# EAGLE design slave_node_v0.1 (EAGLE 9.6.2)

## Sheet 1 of 3
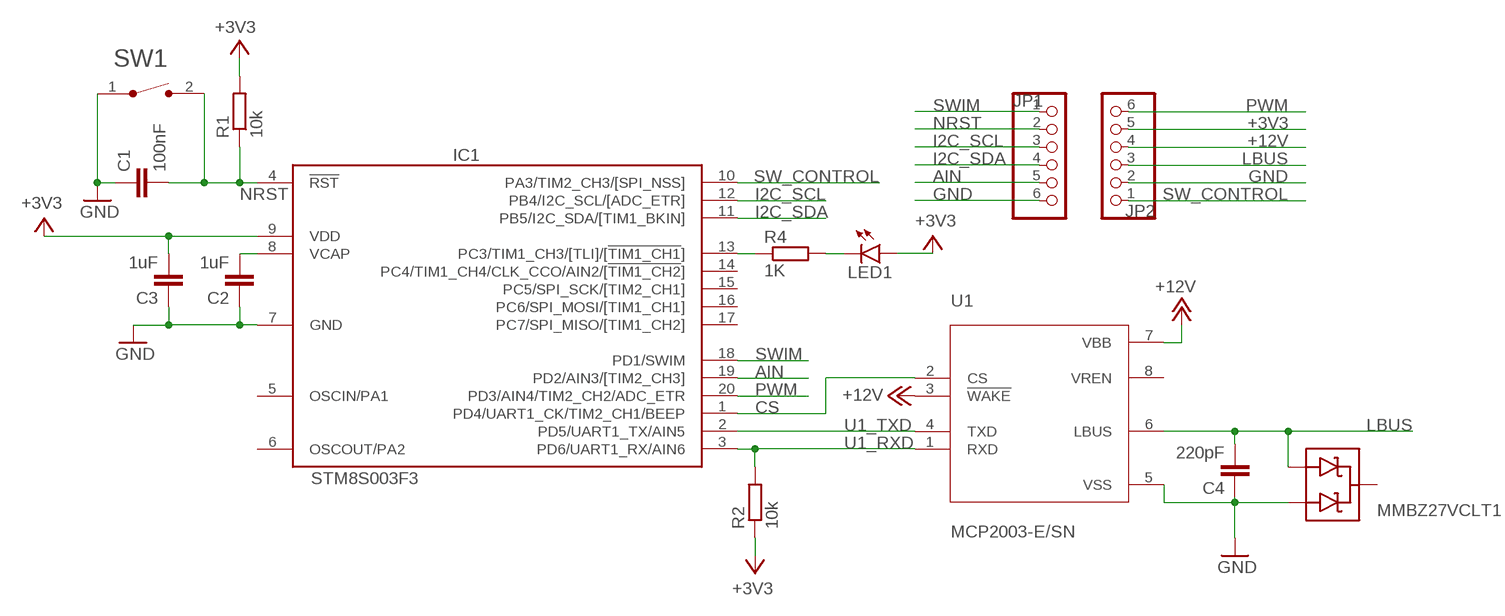
[diagram p0: schematic, sheet 1]

### Parts
C1  100nF  C-EUC0603  [C0603]
C2  1uF  C-EUC0603  [C0603]
C3  1uF  C-EUC0603  [C0603]
C4  220pF  C-EUC0603  [C0603]
D2  MMBZ27VCLT1  [SOT23-3]
IC1  STM8S003F3  [TSSOP20]
JP1  PINHD-1X6  [1X06]
JP2  PINHD-1X6  [1X06]
LED1  LEDCHIP-LED0603  [CHIP-LED0603]
R1  10k  R-EU_R0603  [R0603]
R2  10k  R-EU_R0603  [R0603]
R4  1K  R-EU_R0603  [R0603]
SW1  FSMSM  [TE_FSMSM]
U1  MCP2003-E/SN  [SOIC127P600X175-8N]

### Nets
+3V3: C3.2 IC1.9(VDD) JP2.5 LED1.A R1.2 R2.1 ; also sheet 3
+12V: JP2.4 U1.3(!WAKE) U1.7(VBB) ; also sheet 2,3
AIN: IC1.19(PD2/AIN3/[TIM2_CH3]) JP1.5
CS: IC1.1(PD4/UART1_CK/TIM2_CH1/BEEP) U1.2(CS)
GND: C1.1 C2.1 C3.1 C4.1 D2.1(A1) IC1.7(GND) JP1.6 JP2.2 SW1.1 U1.5(VSS) ; also sheet 2,3
I2C_SCL: IC1.12(PB4/I2C_SCL/[ADC_ETR]) JP1.3
I2C_SDA: IC1.11(PB5/I2C_SDA/[TIM1_BKIN]) JP1.4
LBUS: C4.2 D2.2(A2) JP2.3 U1.6(LBUS)
N$2: C2.2 IC1.8(VCAP)
N$3: LED1.C R4.2
N$4: IC1.13(PC3/TIM1_CH3/[TLI]/[!TIM1_CH1!]) R4.1
NRST: C1.2 IC1.4(!RST) JP1.2 R1.1 SW1.2
PWM: IC1.20(PD3/AIN4/TIM2_CH2/ADC_ETR) JP2.6
SW_CONTROL: IC1.10(PA3/TIM2_CH3/[SPI_NSS]) JP2.1 ; also sheet 2
SWIM: IC1.18(PD1/SWIM) JP1.1
U1_RXD: IC1.3(PD6/UART1_RX/AIN6) R2.2 U1.1(RXD)
U1_TXD: IC1.2(PD5/UART1_TX/AIN5) U1.4(TXD)
Unconnected: D2.3(C) IC1.5(OSCIN/PA1) IC1.6(OSCOUT/PA2) IC1.14(PC4/TIM1_CH4/CLK_CCO/AIN2/[!TIM1_CH2!]) IC1.15(PC5/SPI_SCK/[TIM2_CH1]) IC1.16(PC6/SPI_MOSI/[TIM1_CH1]) IC1.17(PC7/SPI_MISO/[TIM1_CH2]) U1.8(VREN)

## Sheet 2 of 3
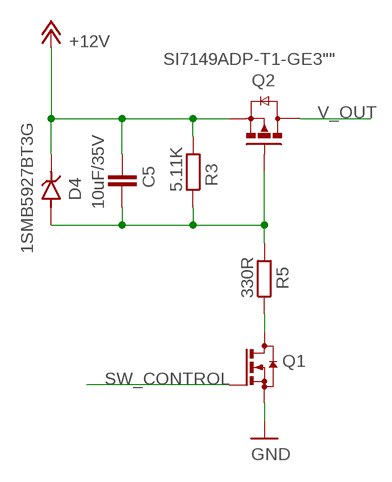
[diagram p1: schematic, sheet 2]

### Parts
C5  C-EUC0603  [C0603]
D4  1SMB5927BT3G  [DIOM5436X247N]
Q1  BSS123  [SOT23]
Q2  SI7149ADP-T1-GE3""  [POWERPAKSO-8]
R3  R-EU_R0603  [R0603]
R5  R-EU_R0603  [R0603]

### Nets
+12V: C5.1 D4.C(K) Q2.1(S) Q2.2(S) Q2.3(S) R3.2 ; also sheet 1,3
GND: Q1.2(S) ; also sheet 1,3
N$5: Q1.3(D) R5.1
N$6: C5.2 D4.A Q2.4(G) R3.1 R5.2
SW_CONTROL: Q1.1(G) ; also sheet 1
V_OUT: Q2.5(D) Q2.6(D) Q2.7(D) Q2.8(D) Q2.9(D)

## Sheet 3 of 3
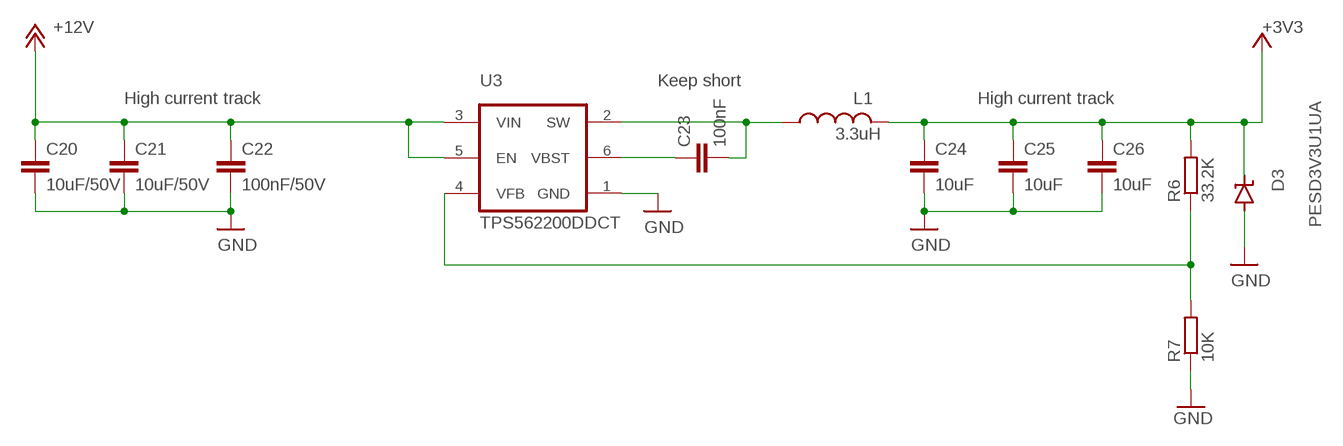
[diagram p2: schematic, sheet 3]

### Parts
C20  10uF/50V  C-EUC0603  [C0603]
C21  10uF/50V  C-EUC0603  [C0603]
C22  100nF/50V  C-EUC0603  [C0603]
C23  100nF  C-EUC0603  [C0603]
C24  10uF  C-EUC0603  [C0603]
C25  10uF  C-EUC0603  [C0603]
C26  10uF  C-EUC0603  [C0603]
D3  PESD3V3U1UA  [SOD323]
L1  3.3uH  MBMK2520H3R3M  [INDC2520X120N]
R6  33.2K  R-EU_R0603  [R0603]
R7  10K  R-EU_R0603  [R0603]
U3  TPS562200DDCT  [SOT95P280X110-6N]

### Nets
+3V3: C24.1 C25.1 C26.1 D3.C L1.2 R6.2 ; also sheet 1
+12V: C20.1 C21.1 C22.1 U3.3(VIN) U3.5(EN) ; also sheet 1,2
GND: C20.2 C21.2 C22.2 C24.2 C25.2 C26.2 D3.A R7.1 U3.1(GND) ; also sheet 1,2
N$21: R6.1 R7.2 U3.4(VFB)
N$29: C23.2 L1.1 U3.2(SW)
N$68: C23.1 U3.6(VBST)

### Notes on the sheet
- Keep short
- High current track | High current track

## Library data of the parts
C1-C4 C20-C26 = rcl:C-EU: CAPACITOR, European symbol; SPICEPREFIX: C
C5 = rcl:C-EU: CAPACITOR, European symbol; C1: 10uF/35V; SPICEPREFIX: C
D2 = opaygolink:MMBZ27VCLT1: 40W Zener-diode transient voltage suppressor (ESD protection); AVAILABILITY: Unavailable; DESCRIPTION: 38V Clamp 1A Ipp Tvs Diode Surface Mount SOT-23-3 _TO-236_; MF: ON Semiconductor; MP: MMBZ27VCLT1; PACKAGE: SOT-23-3 ON Semiconductor; PRICE: None; SPICEPREFIX: U
D3 = opaygolink:PESD3V3U1UA: PESD3V3U1UA
D4 = opaygolink:1SMB5927BT3G: Zener Diode 5.6V 3W ±5% Surface Mount SMB Check prices <https://pricing.snapeda.com/parts/1SMB5927BT3G/ON%20Semiconductor/view-part?ref=eda>; AVAILABILITY: Good; DESCRIPTION: Zener Diode 12V 3W ±5% Surface Mount SMB; MF: ON Semiconductor; MP: 1SMB5927BT3G; PACKAGE: SMB-2 ON Semiconductor; PRICE: None; PURCHASE-URL: https://pricing.snapeda.com/search/part/1SMB5927BT3G/?ref=eda
IC1 = opaygolink:STM8S003: Value line, 16 MHz STM8S 8-bit MCU, 8 Kbytes Flash, 128 bytes data EEPROM, 10-bit ADC, 3 timers, UART, SPI, I2C
JP1 JP2 = opaygolink:PINHD-1X6: PIN HEADER
L1 = opaygolink:MBMK2520H3R3M: INDUCTOR,MCOIL HIGH CURRENT,3.3UH30% ,T&R; DESCRIPTION: 3.3µH Shielded Wirewound Inductor 970mA 260mOhm Max 1008 _2520 Metric_; DIGI-KEY_PART_NUMBER: 587-4723-1-ND; DIGI-KEY_PURCHASE_URL: https://www.digikey.es/product-detail/en/taiyo-yuden/MBMK2520H3R3M/587-4723-1-ND/6181929?utm_source=snapeda&utm_medium=aggregator&utm_campaign=symbol; MF: Taiyo Yuden; MP: MBMK2520H3R3M; PACKAGE: 2520 Taiyo Yuden
LED1 = led:LED: LED OSRAM: - CHIPLED LG R971, LG N971, LY N971, LG Q971, LY Q971, LO R971, LY R971 LH N974, LH R974 LS Q976, LO Q976, LY Q976 LO Q996 - Hyper CHIPLED LW Q18S LB Q993, LB Q99A, LB R99A - SideLED LS A670, LO A670, LY A670, LG A670, LP A670 LB A673, LV A673, LT A673, LW A673 LH A674 LY A675 LS A676, LA A676, LO A676, LY A676, LW A676 LS A679, LY A679, LG A679 - Hyper Micro SIDELED® LS Y876, LA Y876, LO Y876, LY Y876 LT Y87S - SmartLED LW L88C, LW L88S LB L89C, LB L89S, LG L890 LS L89K, LO L89K, LY L89K LS L896, LA L896, LO L896, LY L896 - TOPLED LS T670, LO T670, LY T670, LG T670, LP T670 LSG T670, LSP T670, LSY T670, LOP T670, LYG T670 LG T671, LOG T671, LSG T671 LB T673, LV T673, LT T673, LW T673 LH T674 LS T676, LA T676, LO T676, LY T676, LB T676, LH T676, LSB T676, LW T676 LB T67C, LV T67C, LT T67C, LS T67K, LO T67K, LY T67K, LW E67C LS E67B, LA E67B, LO E67B, LY E67B, LB E67C, LV E67C, LT E67C LW T67C LS T679, LY T679, LG T679 LS T770, LO T770, LY T770, LG T770, LP T770 LB T773, LV T773, LT T773, LW T773 LH T774 LS E675, LA E675, LY E675, LS T675 LS T776, LA T776, LO T776, LY T776, LB T776 LHGB T686 LT T68C, LB T68C - Hyper Mini TOPLED® LB M676 - Mini TOPLED Santana® LG M470 LS M47K, LO M47K, LY M47K Source: http://www.osram.convergy.de LUXEON: - LUMILED® LXK2-PW12-R00, LXK2-PW12-S00, LXK2-PW14-U00, LXK2-PW14-V00 LXK2-PM12-R00, LXK2-PM12-S00, LXK2-PM14-U00 LXK2-PE12-Q00, LXK2-PE12-R00, LXK2-PE12-S00, LXK2-PE14-T00, LXK2-PE14-U00 LXK2-PB12-K00, LXK2-PB12-L00, LXK2-PB12-M00, LXK2-PB14-N00, LXK2-PB14-P00, LXK2-PB14-Q00 LXK2-PR12-L00, LXK2-PR12-M00, LXK2-PR14-Q00, LXK2-PR14-R00 LXK2-PD12-Q00, LXK2-PD12-R00, LXK2-PD12-S00 LXK2-PH12-R00, LXK2-PH12-S00 LXK2-PL12-P00, LXK2-PL12-Q00, LXK2-PL12-R00 Source: www.luxeon.com KINGBRIGHT: KA-3528ASYC Source: www.kingbright.com
Q1 = opaygolink:BSS123
Q2 = opaygolink:SI7149ADP-T1-GE3
R1 R2 R4 R6 R7 = rcl:R-EU_: RESISTOR, European symbol; SPICEPREFIX: R
R3 = rcl:R-EU_: RESISTOR, European symbol; R2: 5.11K; SPICEPREFIX: R
R5 = rcl:R-EU_: RESISTOR, European symbol; R3: 330R; SPICEPREFIX: R
SW1 = opaygolink:FSMSM: Switch Tactile OFF (ON) SPST Rectangular Button Gull Wing 0.05A 12VDC SMD Loose Piece; AVAILABILITY: Unavailable; COMMENT: 1437566-3; CONFIGURATION_POLE-THROW: Single Pole - Single Throw; CONTACT_CURRENT_RATING: 50 mA; DESCRIPTION: Tactile Switch SPST-NO Top Actuated Surface Mount; MF: TE Connectivity; MP: FSMSM; PACKAGE: None; PRICE: None; TE_PURCHASE_URL: https://www.te.com/usa-en/product-1437566-3.html?te_bu=Cor&te_type=disp&te_campaign=seda_glo_cor-seda-global-disp-prtnr-fy19-seda-model-bom-cta_sma-317_1&elqCampaignId=32493
U1 = opaygolink:MCP2003-E/SN: MCP2003 Series 6 to 27 V Bidirectional LIN J2602 Transceiver SMT - SOIC-8; AVAILABILITY: Unavailable; DESCRIPTION: 1/1 Transceiver Half LINbus 8-SOIC; MF: Microchip; MP: MCP2003-E/SN; PACKAGE: SO-8 Microchip; PRICE: None
U3 = opaygolink:TPS562200DDCT: Check prices <https://pricing.snapeda.com/parts/TPS562200DDCT/Texas%20Instruments/view-part?ref=eda>; AVAILABILITY: Warning; DESCRIPTION: 17 V Input, 2A Synchronous Step-Down Regulator in SOT-23 with Advanced Eco-mode&trade; 6-SOT-23-THIN -40 to 125; MF: Texas Instruments; MP: TPS562200DDCT; PACKAGE: SOT-23-THN-6 Texas Instruments; PRICE: None; PURCHASE-URL: https://pricing.snapeda.com/search/part/TPS562200DDCT/?ref=eda

## Board
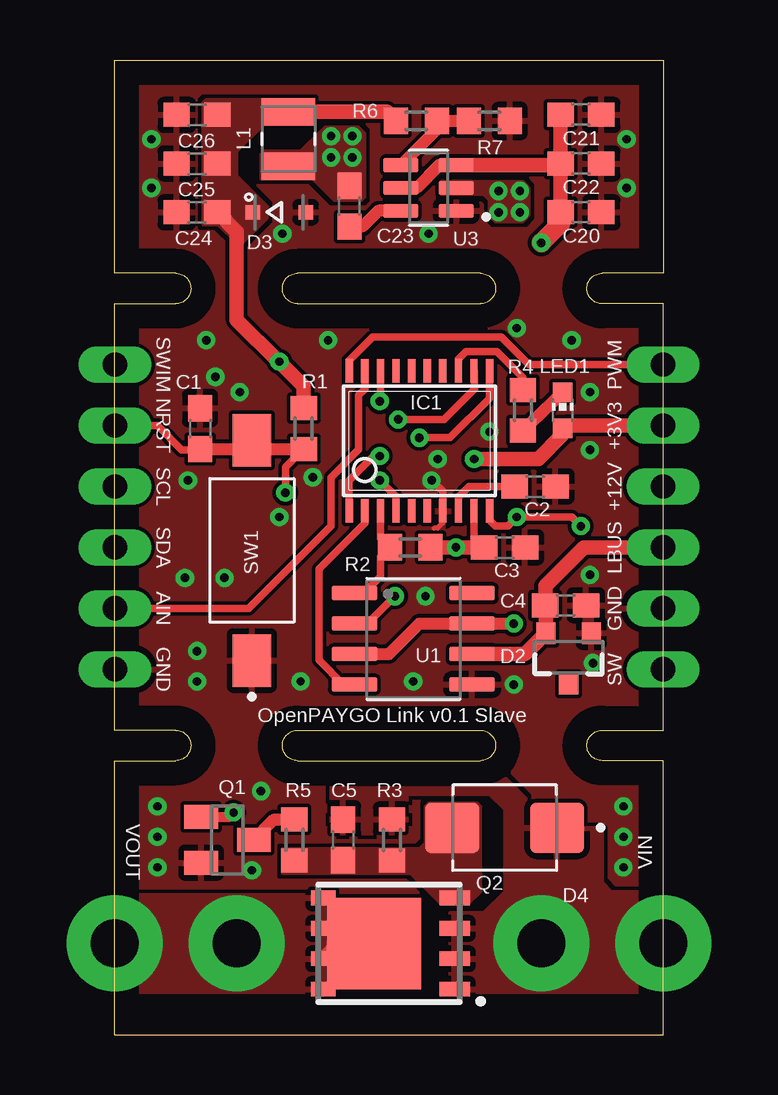
[diagram p3: board, top side]
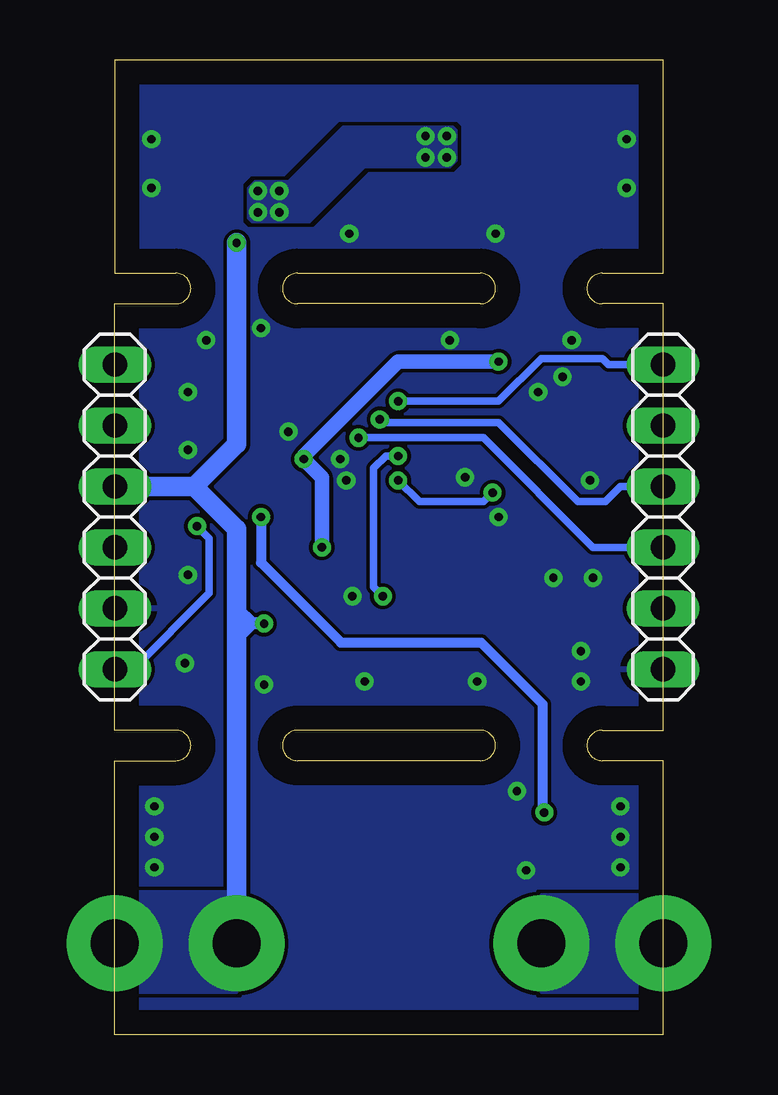
[diagram p4: board, bottom side, seen from below]

Size 22.86 x 40.64 mm. Coordinates in mm from the lower left corner, seen from the top.
Outline: 0,0 0,11.43 2.54,11.43 arc180 2.54,12.7 0,12.7 0,30.48 2.54,30.48 arc180 2.54,31.75 0,31.75 0,40.64 22.86,40.64 22.86,31.75 20.32,31.75 arc180 20.32,30.48 22.86,30.48 22.86,12.7 20.32,12.7 arc180 20.32,11.43 22.86,11.43 22.86,0 0,0
Outline: 7.62,11.43 arc-180 7.62,12.7 15.24,12.7 arc-180 15.24,11.43 7.62,11.43
Outline: 15.24,31.75 arc-180 15.24,30.48 7.62,30.48 arc-180 7.62,31.75 15.24,31.75
Copper layers (1*16): Top 0.035mm / dielectric 1.5mm / Bottom 0.035mm
Design rules "default": minimum track width 6mil, minimum drill 0.35mm, track to track 6mil, track to pad 6mil, pad to pad 6mil, via to via 6mil, smd to smd 6mil, copper to edge 40mil, drill to drill 6mil, minimum pad ring 10mil, minimum via ring 8mil, stop-mask expansion 4mil, vias tented up to drill 0mil, thermal gap 10mil

### Footprints (pad centres in the part's own frame; a part is rotated, then mirrored left to right if it is on the bottom)
C0603 = smd 1.1 x 1: 1 -0.85,0; 2 0.85,0
SOT23-3 = smd 0.8 x 0.9: 1 -0.95,-1; 2 0.95,-1; 3 0,1.1
SOD323 = smd 0.6 x 0.6: A 1.1,0; C -1.1,0
DIOM5436X247N = smd 2.25 x 2.12: A 2.185,0; C -2.185,0
TSSOP20 = smd 0.305 x 0.991: 1 -2.925,-2.918; 2 -2.275,-2.918; 3 -1.625,-2.918; 4 -0.975,-2.918; 5 -0.325,-2.918; 6 0.325,-2.918; 7 0.975,-2.918; 8 1.625,-2.918; 9 2.275,-2.918; 10 2.925,-2.918; 11 2.925,2.918; 12 2.275,2.918; 13 1.625,2.918; 14 0.975,2.918; 15 0.325,2.918; 16 -0.325,2.918; 17 -0.975,2.918; 18 -1.625,2.918; 19 -2.275,2.918; 20 -2.925,2.918
1X06 = drill 1.016 long: 1 -6.35,0; 2 -3.81,0; 3 -1.27,0; 4 1.27,0; 5 3.81,0; 6 6.35,0
INDC2520X120N = smd 1.14 x 2.22: 1 -1.14,0; 2 1.14,0
CHIP-LED0603 = smd 0.8 x 0.8: A 0,-0.75; C 0,0.75
SOT23 = smd 1 x 1.4: 1 -0.95,-1.1; 2 0.95,-1.1; 3 0,1.1
POWERPAKSO-8 = smd 1.27 x 0.61: 1 -2.732,1.905; 2 -2.732,0.635; 3 -2.732,-0.635; 4 -2.732,-1.905 | smd 1.02 x 0.61: 5 2.732,-1.905; 6 2.732,-0.635; 7 2.732,0.635; 8 2.732,1.905 | smd 3.91 x 3.81: 9 0.627,0
R0603 = smd 1 x 1.1: 1 -0.85,0; 2 0.85,0
TE_FSMSM = smd 2.19 x 1.6: 1 -4.59,0; 2 4.59,0
SOIC127P600X175-8N = smd 1.9 x 0.6: 1 -2.455,1.905; 2 -2.455,0.635; 3 -2.455,-0.635; 4 -2.455,-1.905; 5 2.455,-1.905; 6 2.455,-0.635; 7 2.455,0.635; 8 2.455,1.905
SOT95P280X110-6N = smd 1.45 x 0.59: 1 -1.155,0.95; 2 -1.155,0; 3 -1.155,-0.95; 4 1.155,-0.95; 5 1.155,0; 6 1.155,0.95

### Placement (x,y rotation side)
C1  3.56,25.27 270 top
C2  17.53,22.86 180 top
C3  16.26,20.32 180 top
C4  18.8,17.91 180 top
C5  9.53,8.13 270 top
C20  19.43,34.29 0 top
C21  19.43,38.35 0 top
C22  19.43,36.32 0 top
C23  9.78,34.54 90 top
C24  3.43,34.29 180 top
C25  3.43,36.32 180 top
C26  3.43,38.35 180 top
D2  18.92,15.75 180 top
D3  6.86,34.29 0 top
D4  16.26,8.64 180 top
IC1  12.7,24.77 0 top
JP1  0,21.59 270 bottom
JP2  22.86,21.59 90 bottom
L1  7.24,37.34 90 top
LED1  18.67,26.04 0 top
Q1  4.7,8.13 270 top
Q2  11.43,3.81 180 top
R1  7.87,25.27 90 top
R2  12.32,20.32 180 top
R3  11.56,8.13 90 top
R4  17.02,26.04 270 top
R5  7.49,8.13 270 top
R6  12.57,38.1 180 top
R7  15.62,38.1 180 top
SW1  5.71,20.19 90 top
U1  12.45,16.51 0 top
U3  13.08,35.31 180 top

### Tracks (layer width: path | path; a pad name or v marks a point on that pad's centre or on a via)
+3V3  (via drill 0.35)
  Top 0.305: R2.1 13.46,20.32 | IC1.9 14.97,20.44 14.86,20.32
  Top 0.61: 7.12,38.35 L1.2 11.35,38.48 R6.2 | C24.1 5.08,33.49 5.08,29.81 6.82,28.07 v6.86,28.07 7.87,27.05 R1.2 | v14.99,24 17.65,24 18.67,25.02 LED1.A 18.78,25.4 JP2.5 | R2.1 v14.22,20.32 14.86,20.32 C3.2
  Bottom 0.61: v6.86,28.07 11.05,28.07 14.99,24.13 v14.99,24 14.22,23.24 v14.22,20.32
  pour Top (no thermals): 3.68,33.78 3.68,38.86 3.81,38.99 8.26,38.99 8.26,37.97 6.22,37.97 5.08,36.83 5.08,35.81 6.35,34.54 6.35,34.04 5.33,33.02 5.08,33.02 4.32,33.78
+12V  (via drill 0.35, 2 pad 4)
  Top 0.508: U3.3 13.52,36.26 12.57,35.31 U3.5 | U1.3 11.43,15.88 12.7,17.14 U1.7 v16.64,17.14
  Top 0.61: U3.3 18.52,36.26 C22.1 | C22.1 C21.1 | C22.1 C20.1
  Top 0.813: C20.1 18.58,33.82 v17.78,33.02
  Bottom 0.508: 17.65,17.14 17.78,17.14 | 17.14,17.14 17.78,17.78 | v16.64,17.14 17.14,17.14 | 17.14,17.14 17.78,16.51
  Bottom 0.813: JP2.4 19.56,22.86 | 19.56,22.86 17.78,21.08 17.78,17.78 17.78,17.14 17.78,16.51 v17.78,3.81 | 19.56,22.86 17.78,24.64 v17.78,33.02
  other vias: 22.86,3.81
  pour Top: 22.86,1.78 13.97,1.78 13.97,5.08 15.37,5.08 16.26,5.97 16.26,9.4 15.62,10.03 12.19,10.03 12.19,8.38 9.02,8.38 9.02,10.79 16.21,10.79 18.37,8.64 20.19,8.64 20.32,8.51 20.32,6.35 20.7,5.97 22.86,5.97 22.86,5.97
  pour Bottom: 22.86,5.97 17.78,5.97 17.78,1.78 22.86,1.78
AIN
  Top 0.305: IC1.19 10.43,26.92 10.17,26.67 10.17,24.39 9.02,23.24 9.02,21.21 5.59,17.78 JP1.5
CS  (via drill 0.35)
  Top 0.305: U1.2 10.54,17.14 v11.68,18.29 | v11.05,24.13 10.79,24.13 9.78,23.11 IC1.1
  Bottom 0.305: v11.68,18.29 12.06,18.67 12.06,23.62 11.56,24.13 v11.05,24.13 10.92,24.13
GND  (via drill 0.35)
  Top 0.203: IC1.7 13.68,21.34 13.46,21.12 13.31,21.12
  Top 0.305: IC1.7 13.68,22.65 v13.21,23.11
  other vias: 6.99,33.4 13.08,33.4 1.52,37.34 1.52,35.31 21.34,35.31 21.34,37.34 13.46,24 15.62,25.15 12.95,18.29 12.45,14.73 19.81,19.18 19.05,28.96 19.81,26.8 19.81,24.38 19.94,15.49 16.64,14.61 21.21,6.99 21.21,9.53 21.21,8.26 1.78,6.99 1.78,8.26 1.78,9.53 5.71,6.86 6.1,10.16 7.75,14.73 3.43,14.73 3.43,16 2.92,19.05 6.86,21.59 4.57,19.05 8.26,23.24 3.05,23.11 4.19,27.43 5.21,26.8 3.81,28.96 8.89,28.96 16.76,29.46
  pour Top (rank 6): 0,0 22.86,0 22.86,40.64 0,40.64
  pour Bottom (rank 6): 0,0 22.86,0 22.86,40.64 0,40.64
I2C_SCL  (via drill 0.35)
  Top 0.305: v11.81,25.65 13.72,25.65 14.99,26.92 14.99,27.67 IC1.12
  Bottom 0.305: v11.81,25.65 11.68,25.53 6.86,25.53 3.56,22.23 2.41,22.23 1.78,22.86 JP1.3
I2C_SDA  (via drill 0.35)
  Top 0.305: IC1.11 15.62,26.54 13.98,24.89 v12.7,24.89
  Bottom 0.305: JP1.4 2.92,20.32 7.49,24.89 v12.7,24.89
LBUS
  Top 0.61: U1.6 17.1,15.88 D2.2 17.97,17.88 C4.2 17.95,18.71 19.56,20.32 JP2.3
N$2
  Top 0.305: C2.2 14.77,22.86 14.32,22.41 IC1.8
N$3
  Top 0.508: R4.2 17.37,25.54 LED1.C
N$4
  Top 0.305: IC1.13 14.32,28.17 14.64,28.48 15.93,28.48 17.02,27.39 R4.1
N$5
  Top 0.508: Q1.3 6.65,8.98 R5.1
N$6
  pour Top (no thermals): 13.59,5.46 14.73,5.46 15.24,5.97 15.24,9.53 15.11,9.65 13.08,9.65 12.95,9.53 12.95,8 12.7,7.75 6.99,7.75 6.99,6.73 12.32,6.73
N$21
  Top 0.508: U3.4 13.42,37.75 R6.1 R7.2
N$29  (via drill 0.35)
  other vias: 16,35.18 16.89,35.18 16,34.29 16.89,34.29 9.02,37.47 9.91,37.47 9.91,36.58 9.02,36.58
  pour Top (no thermals): 13.59,35.56 17.02,35.56 17.27,35.31 17.27,34.16 17.02,33.91 15.88,33.91 15.62,34.16 15.62,34.8 15.37,35.05 13.59,35.05
  pour Top (no thermals): 6.1,35.69 8.26,35.69 9.14,34.8 9.27,34.8 10.29,34.8 10.41,34.92 10.41,37.59 10.16,37.85 8.76,37.85 8.64,37.72 7.75,36.83 7.62,36.83 6.22,36.83 6.1,36.7
  pour Bottom (no thermals): 8.76,37.85 13.34,37.85 15.62,35.56 17.02,35.56 17.27,35.31 17.27,34.04 17.14,33.91 14.73,33.91 12.45,36.2 8.89,36.2 8.64,36.45 8.64,37.72
N$68
  Top 0.508: U3.6 10.99,34.36 10.33,33.69 C23.1
NRST  (via drill 0.35)
  Top 0.305: IC1.4 11.72,22.44 v11.05,23.11 | JP1.2 1.78,25.4 | 1.78,25.4 1.82,25.4 | v7.11,22.61 7.11,23.66 R1.1 | 1.78,25.4 2.79,24.38 3.52,24.38 C1.2
  Top 0.508: C1.2 5.36,24.42 | 6.08,24.42 R1.1
  Top 0.61: C1.2 3.56,24.4 | 5.71,25.57 SW1.2 | 5.36,24.42 SW1.2 | SW1.2 6.08,24.42
  Bottom 0.305: v11.05,23.11 10.16,22.23 7.49,22.23 v7.11,22.61
PWM
  Top 0.305: JP2.6 17.27,27.94 16.13,29.08 10.75,29.08 9.78,28.11 IC1.20
SW_CONTROL  (via drill 0.35)
  Top 0.305: IC1.10 15.62,21.46 15.88,21.21 16.38,21.21 v16.76,21.59 19.05,21.59 v19.43,21.21
  Top 0.406: v4.95,9.27 4.76,9.08 Q1.1
  Bottom 0.305: JP2.1 22.1,15.24 18.92,18.41 18.92,20.7 v19.43,21.21
  Bottom 0.406: v4.95,9.27 5.03,9.35 5.03,13.79 7.59,16.36 13.43,16.36 16.76,19.68 v16.76,21.59
SWIM  (via drill 0.35)
  Top 0.305: IC1.18 11.07,26.44 v11.05,26.42
  Bottom 0.305: v11.05,26.42 6.86,26.42 5.08,28.19 2.54,28.19 2.29,27.94 JP1.1
U1_RXD
  Top 0.305: U1.1 10.37,18.41 11.07,19.12 11.07,19.93 R2.2 11.07,20.71 IC1.3
U1_TXD
  Top 0.305: IC1.2 10.43,21.35 8.51,19.43 8.51,15.62 9.53,14.61 U1.4
V_OUT  (via drill 2 pad 4)
  Top 0.61: Q2.7 9.33,3.81 Q2.9
  other vias: 0,3.81 5.08,3.81
  pour Top: 0,1.78 8.89,1.78 8.89,5.84 0,5.84
  pour Bottom (no thermals): 0,5.84 5.08,5.84 5.08,1.78 0,1.78

### Text on the board
tNames: SWIM | PWM | NRST | +3V3 | SCL | +12V | SDA | LBUS | AIN | GND | GND | SW | OpenPAYGO Link v0.1 Slave | VOUT | VIN